# EasyEDA Pro project 无人机主控.epro, board PCB_PCB_PCB_STM32F103C8T6(gift)_2023-09-09_2023-10-22 copy(1)
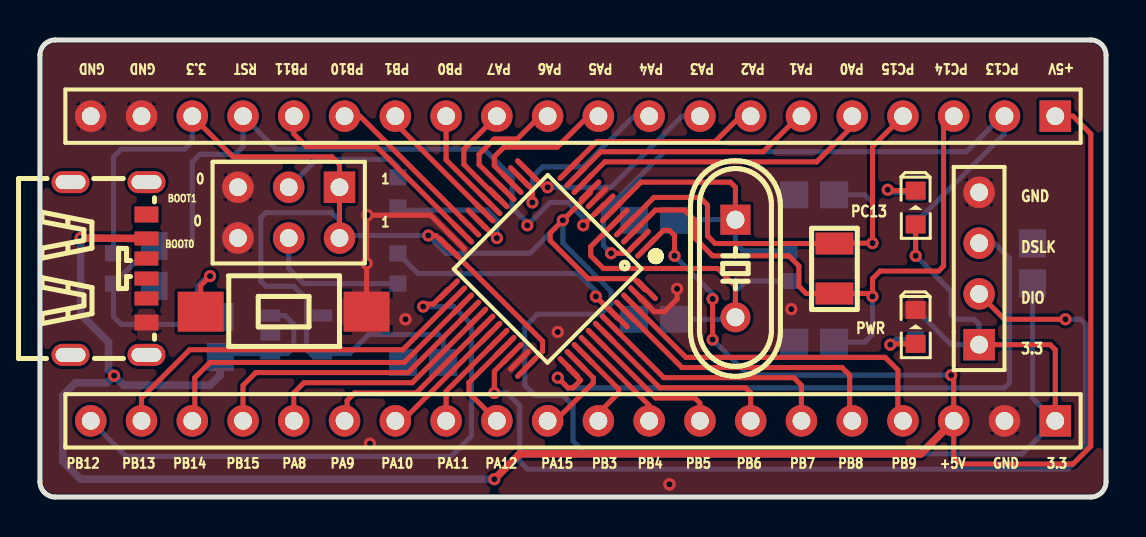
[diagram p1: board, top side]
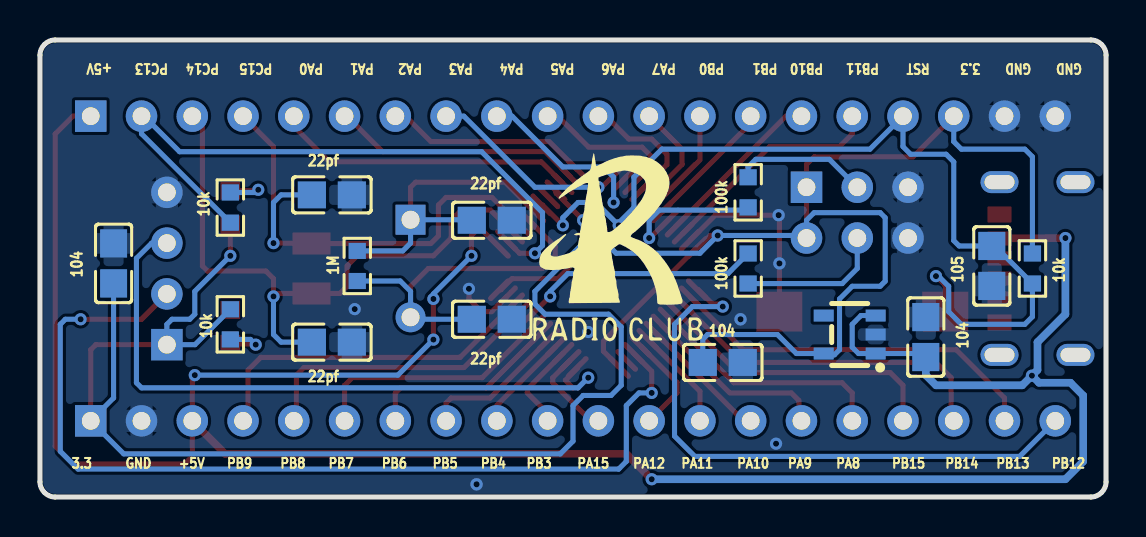
[diagram p2: board, bottom side, seen from below]

Outline 53.34 x 22.86 mm; copper layers: Top Layer, Bottom Layer. Coordinates in mm from the lower left corner of the outline.
Outline path: 0,22.1 arc(0.22,22.64) 0.76,22.86 52.58,22.86 arc(53.12,22.64) 53.34,22.1 53.34,0.76 arc(53.12,0.22) 52.58,0 0.76,0 arc(0.22,0.22) 0,0.76 0,22.1

## Design rules (mm)
spacing Default (default): track to track 0.152, other pairs 0 to 0.152
track width Default (default): min 0.254, default 0.254, max 25.4
via Default (default): diameter min 0.61, default 0.61, max 100.025; hole min 0.305, default 0.305, max 59.995
pour e270 uses gge11324
pour e448 uses gge11333

## Placement (name value [footprint] x y rotation side)
C1  20pF  [C0805]  30.73 8.89 180 bottom
C2  20pF  [C0805]  30.73 13.84 180 bottom
C3  20pF  [C0805]  38.74 7.75 0 bottom
C4  20pF  [C0805]  38.74 15.11 0 bottom
C5  104  [C0805]  9.02 8 270 bottom
C6  104  [C0805]  49.66 11.68 270 bottom
C7  104  [C0805]  19.18 6.73 0 bottom
C8  105  [C0805]  5.72 11.56 270 bottom
H1  HDR-F-2.54_1x4  [HDR-F-2.54_1X4]  46.99 11.43 90 top
H2  HDR-F-2.54_1x20  [HDR-F-2.54_1X20]  26.67 19.05 180 top
H3  HDR-F-2.54_1x20  [HDR-F-2.54_1X20]  26.67 3.81 180 top
J1  HDR-M-2.54_2x3  [HDR-M-2.54_2X3]  14.99 15.49 180 top
LED1  LED-0603_R  [LED0603_RED]  43.82 14.48 90 top
LED2  LED-0603_R  [LED0603_RED]  43.82 8.51 90 top
R1  1M  [R0603]  37.47 11.56 270 bottom
R2  10k  [R0603]  43.81 8.64 270 bottom
R3  1k  [R0603]  43.81 14.48 90 bottom
R4  100k  [R0603]  17.91 15.24 90 bottom
R5  100k  [R0603]  17.91 11.43 270 bottom
R6  10k  [R0603]  3.68 11.43 270 bottom
SW1  1TS002B-2500-5000  [SW-SMD_L3.5-W6.0-P8.20]  12.19 9.27 0 top
U1  TPS70933DBVR-TP  [SOT-23-5_L3.0-W1.7-P0.95-LS2.8-BR]  12.83 8.13 180 bottom
U2  STM32F103C8T6  [LQFP-48_L7.0-W7.0-P0.50-LS9.0-BL]  25.4 11.43 135 top
USB1  TYPE-C 6P  [TYPE-C-SMD_TYPE-C-6P]  3.43 11.43 270 top
X1  8MHz  [HC-49US_L11.5-W4.5-P4.88]  34.8 11.43 270 top
Y1  32.768kHz  [SMD3215]  39.75 11.43 270 top

## Footprints (pads in the part's own frame, mm; a bottom-side part is the same pattern mirrored in y, then rotated)
C0805
  rect 1.41x1.35 smd: 1(-1,0) 2(1,0)
HC-49US_L11.5-W4.5-P4.88
  rect 1.5x1.5 hole 0.9: 1(-2.44,0)
  round 1.5 hole 0.9: 2(2.44,0)
HDR-F-2.54_1X4
  rect 1.575x1.575 hole 0.889: 1(-3.81,0)
  round 1.575 hole 0.889: 2(-1.27,0) 3(1.27,0) 4(3.81,0)
HDR-F-2.54_1X20
  rect 1.575x1.575 hole 0.889: 1(-24.13,0)
  round 1.575 hole 0.889: 2(-21.59,0) 3(-19.05,0) 4(-16.51,0) 5(-13.97,0) 6(-11.43,0) 7(-8.89,0) 8(-6.35,0) 9(-3.81,0) 10(-1.27,0) 11(1.27,0) 12(3.81,0) 13(6.35,0) 14(8.89,0) 15(11.43,0) 16(13.97,0) 17(16.51,0) 18(19.05,0) 19(21.59,0) 20(24.13,0)
HDR-M-2.54_2X3
  rect 1.575x1.575 hole 0.889: 1(0,0)
  round 1.575 hole 0.889: 2(0,2.54) 3(2.54,0) 4(2.54,2.54) 5(5.08,0) 6(5.08,2.54)
LED0603_RED
  rect 0.9x1 smd: 1(-0.85,0) 2(0.85,0)
LQFP-48_L7.0-W7.0-P0.50-LS9.0-BL
  oval 0.27x1.5 smd: 1(-2.75,-4.25) 2(-2.25,-4.25) 3(-1.75,-4.25) 4(-1.25,-4.25) 5(-0.75,-4.25) 6(-0.25,-4.25) 7(0.25,-4.25) 8(0.75,-4.25) 9(1.25,-4.25) 10(1.75,-4.25) 11(2.25,-4.25) 12(2.75,-4.25) 25(2.75,4.25) 26(2.25,4.25) 27(1.75,4.25) 28(1.25,4.25) 29(0.75,4.25) 30(0.25,4.25) 31(-0.25,4.25) 32(-0.75,4.25) 33(-1.25,4.25) 34(-1.75,4.25) 35(-2.25,4.25) 36(-2.75,4.25)
  oval 1.5x0.27 smd: 13(4.25,-2.75) 14(4.25,-2.25) 15(4.25,-1.75) 16(4.25,-1.25) 17(4.25,-0.75) 18(4.25,-0.25) 19(4.25,0.25) 20(4.25,0.75) 21(4.25,1.25) 22(4.25,1.75) 23(4.25,2.25) 24(4.25,2.75) 37(-4.25,2.75) 38(-4.25,2.25) 39(-4.25,1.75) 40(-4.25,1.25) 41(-4.25,0.75) 42(-4.25,0.25) 43(-4.25,-0.25) 44(-4.25,-0.75) 45(-4.25,-1.25) 46(-4.25,-1.75) 47(-4.25,-2.25) 48(-4.25,-2.75)
R0603
  rect 0.806x0.864 smd: 1(-0.753,0) 2(0.753,0)
SMD3215
  rect 1.1x1.9 smd: 1(-1.25,0) 2(1.25,0)
SOT-23-5_L3.0-W1.7-P0.95-LS2.8-BR
  rect 1x0.6 smd: 1(1.3,-0.95) 2(1.3,0) 3(1.3,0.95) 4(-1.3,0.95) 5(-1.3,-0.95)
SW-SMD_L3.5-W6.0-P8.20
  rect 2.3x2 smd: A(-4.15,0) B(4.15,0)
TYPE-C-SMD_TYPE-C-6P
  oval 1.1x1.9 hole 0.7x1.5: 7(-4.32,1.9) 7(-4.32,-1.9) 7(4.32,1.9) 7(4.32,-1.9)
  rect 0.7x1.2 smd: A5(-0.5,1.9) A9(1.5,1.9) B5(0.5,1.9) B9(-1.5,1.9)
  rect 0.8x1.2 smd: A12(2.7,1.9) B12(-2.7,1.9)

## Nets
+3.3V: C6.2 C7.2 H1.1 H2.18 H3.1 J1.1 J1.2 LED1.1 R2.1 R6.1 U1.5 U2.9 U2.24 U2.36 U2.48
+5V: C5.2 H2.1 H3.3 U1.1 U1.3 U2.1 USB1.B9
GND: C1.2 C2.2 C3.1 C4.1 C5.1 C6.1 C7.1 C8.2 H1.4 H2.19 H2.20 H3.2 J1.5 J1.6 LED2.2 SW1.B U1.2 U2.8 U2.23 U2.35 U2.47 USB1.A12
BOOT0: R5.1 U2.44
BOOT1: R4.1 U2.20
J1_3: J1.3 R4.2
J1_4: J1.4 R5.2
LED1_2: LED1.2 R3.2
OSC1: C1.1 R1.2 U2.5 X1.2
OSC2: C2.1 R1.1 U2.6 X1.1
PA0: H2.5 U2.10
PA1: H2.6 U2.11
PA2: H2.7 U2.12
PA3: H2.8 U2.13
PA4: H2.9 U2.14
PA5: H2.10 U2.15
PA6: H2.11 U2.16
PA7: H2.12 U2.17
PA8: H3.16 U2.29
PA9: H3.15 U2.30
PA10: H3.14 U2.31
PA11: H3.13 U2.32
PA12: H3.12 U2.33
PA13: H1.2 U2.34
PA14: H1.3 U2.37
PA15: H3.11 U2.38
PB0: H2.13 U2.18
PB1: H2.14 U2.19
PB3: H3.10 U2.39
PB4: H3.9 U2.40
PB5: H3.8 U2.41
PB6: H3.7 U2.42
PB7: H3.6 U2.43
PB8: H3.5 U2.45
PB9: H3.4 U2.46
PB10: H2.15 U2.21
PB11: H2.16 U2.22
PB12: H3.20 U2.25
PB13: H3.19 U2.26
PB14: H3.18 U2.27
PB15: H3.17 U2.28
PC13: H2.2 R3.1 U2.2
PC14: C3.2 H2.3 U2.3 Y1.2
PC15: C4.2 H2.4 U2.4 Y1.1
R2_2: LED2.1 R2.2
RST: C8.1 H2.17 R6.2 SW1.A U2.7

Pads without a net: U1 4; USB1 7 A5 A9 B5 B12

## Via types
v1: diameter 0.61, hole 0.305, Top Layer to Bottom Layer, 30 vias
v2: diameter 0.62, hole 0.31, Top Layer to Bottom Layer, 4 vias

## Routing (per net, layer and track width the routed paths; a pad name or vN(x,y) marks a point on that pad's centre or on a via; arc(x,y) is an arc through that point)
+3.3V: length 145.3
  Top Layer w0.254: H3.1 50.8,7.37 50.55,7.62 H1.1 ; 15.37,12.45 14.99,12.83 J1.1 14.99,16.64 14.6,17.02 9.65,17.02 H2.18 ; U2.36 25.15,7.29 25.15,7.8 U2.24 20.4,12.49 19.81,13.08 v1(19.43,13.08) ; LED1.1 v1(43.81,12.06) ; U2.9 27.52,15.2 v1(26.16,13.84) 25.53,13.21 25.53,12.83 27.43,10.92 29.72,10.92 30.27,10.37 U2.48
  Bottom Layer w0.254: R6.1 3.68,17.02 4.06,17.4 7.24,17.4 7.62,17.78 H2.18 ; v1(43.81,12.06) 45.59,10.29 45.59,9.14 45.85,8.89 46.74,8.89 46.99,8.64 H1.1 45.58,7.62 R2.1 ; C7.2 20.18,7.89 19.94,8.13 16.44,8.13 15.49,7.18 U1.5 14.06,7.11 13.59,7.11 13.34,7.37 13.34,9.91 12.7,10.54 11.3,10.54 11.05,10.8 11.05,13.97 11.3,14.22 14.6,14.22 14.99,13.84 J1.2 15.11,13.08 v1(19.43,13.08) 20.32,12.19 24.51,12.19 v1(26.16,13.84) 26.16,12.7 28.57,10.29 28.57,9.65 28.07,9.14 24.89,9.14 24.26,8.51 24.26,5.59 24.76,5.08 26.16,5.08 26.67,4.57 26.67,2.79 27.31,2.16 49.15,2.16 H3.1 49.66,4.95 C6.2
+5V: length 126.1
  Top Layer w0.254: v1(33.66,9.91) v1(33.66,7.87) ; H2.1 51.69,19.05 52.58,18.16 52.58,2.54 51.69,1.65 46.1,1.65 45.72,2.03 H3.3 45.72,5.97 v1(45.59,6.1) ; U2.1 31.19,13.33 31.5,13.33 31.75,13.08 v1(31.75,12.06)
  Top Layer w0.381: H3.3 44.07,2.16 24,2.16 v1(22.73,0.89) ; v1(2.03,12.95) 5.33,12.93
  Bottom Layer w0.254: v1(45.59,6.1) 35.43,6.1 v1(33.66,7.87) ; C5.2 9.19,7.18 U1.1 12.38,7.18 12.7,7.49 12.7,8.64 12.26,9.08 U1.3 ; v1(33.66,9.91) 33.66,10.16 v1(31.75,12.06)
  Bottom Layer w0.381: C5.2 9.02,6.1 8.51,5.59 4.19,5.59 v1(3.71,6.07) ; v1(22.73,0.89) 2.03,0.89 1.14,1.78 1.14,5.08 1.78,5.72 3.35,5.72 v1(3.71,6.07) ; v1(3.71,6.07) 3.43,6.35 3.43,7.75 2.03,9.14 v1(2.03,12.95)
GND: length 12.7
  Top Layer w0.254: U2.47 30.74,9.27 31.24,9.27 31.88,9.91 v1(31.88,10.41) ; U2.23 19.55,14.1 v2(16.38,14.1) 16.34,14.06 SW1.B
  vias: v1(16.51,2.67) v1(25.91,8.25) v1(37.59,9.4) v2(16.34,11.68) v2(18.29,8.89) v2(31.5,0.64)
BOOT0: length 12.5
  Top Layer w0.254: U2.44 28.89,8.95 v1(27.81,10.03)
  Bottom Layer w0.254: v1(27.81,10.03) 27.81,10.29 26.92,11.18 18.91,11.18 R5.1
BOOT1: length 7.5
  Top Layer w0.254: v1(22.86,12.95) 22.81,12.95 U2.20
  Bottom Layer w0.254: R4.1 18.04,14.35 22.35,14.35 22.86,13.84 v1(22.86,12.95)
J1_3: length 6.7
  Bottom Layer w0.254: R4.2 17.91,16.51 17.53,16.89 13.84,16.89 J1.3
J1_4: length 7.3
  Bottom Layer w0.254: R5.2 13.2,10.68 12.45,11.43 J1.4
LED1_2: length 2.9
  Top Layer w0.254: v1(42.42,15.37) 42.46,15.33 LED1.2
  Bottom Layer w0.254: v1(42.42,15.37) 42.55,15.23 R3.2
OSC1: length 19.1
  Top Layer w0.254: U2.5 27.56,12.53 27.56,12.06 28.19,11.43 33.91,11.43 34.8,10.54 X1.2
  Bottom Layer w0.254: R1.2 35.31,10.8 34.8,10.29 X1.2 34.7,8.89 C1.1
OSC2: length 15.6
  Top Layer w0.254: X1.1 34.8,15.49 34.54,15.75 30.07,15.75 U2.6
  Bottom Layer w0.254: R1.1 35.19,12.31 34.8,12.7 X1.1 31.76,13.87 C2.1
PA0: length 15.2
  Top Layer w0.254: U2.10 28.26,16.76 38.86,16.76 40.64,18.54 H2.5
PA1: length 12.5
  Top Layer w0.254: U2.11 28.06,17.27 36.19,17.27 37.97,19.05 H2.6
PA2: length 10.2
  Top Layer w0.254: U2.12 27.86,17.78 33.78,17.78 35.05,19.05 H2.7
PA3: length 10.5
  Top Layer w0.254: U2.13 25.22,15.49 v1(25.4,15.49)
  Bottom Layer w0.254: v1(25.4,15.49) 28.57,15.49 32.13,19.05 H2.8
PA4: length 9.9
  Top Layer w0.254: v1(24.64,14.73) 24.64,15.37 U2.14
  Bottom Layer w0.254: v1(24.64,14.73) 24.64,16 25.15,16.51 27.18,16.51 29.72,19.05 H2.9
PA5: length 7.8
  Top Layer w0.254: H2.10 27.43,19.05 25.88,17.5 23.21,17.5 22.73,17.02 22.73,16.57 U2.15
PA6: length 6.6
  Top Layer w0.254: H2.11 25.02,19.05 23.88,17.91 22.73,17.91 21.97,17.14 21.97,16.63 U2.16
PA7: length 5.5
  Top Layer w0.254: H2.12 21.21,17.4 21.21,16.64 22.88,14.97 22.93,14.97
PA8: length 12.1
  Top Layer w0.254: H3.16 12.7,5.21 13.21,5.72 18.62,5.72 U2.29
PA9: length 9.5
  Top Layer w0.254: U2.30 18.82,5.21 15.75,5.21 15.37,4.83 15.37,3.94 H3.15
PA10: length 6.6
  Top Layer w0.254: U2.31 18.13,3.81 H3.14
PA11: length 5.2
  Top Layer w0.254: 22.93,7.89 20.32,5.29 H3.13
PA12: length 5.1
  Top Layer w0.254: 23.28,7.54 21.46,5.72 21.46,5.21 H3.12
PA13: length 47.8
  Top Layer w0.254: v1(22.73,5.21) 22.73,6.29 U2.34 ; v1(51.31,8.89) 48.26,8.89 H1.2
  Bottom Layer w0.254: v1(51.31,8.89) 52.07,8.89 52.32,8.64 52.32,2.29 51.44,1.4 24.38,1.4 24,1.78 24,4.57 23.37,5.21 v1(22.73,5.21)
PA14: length 33.4
  Top Layer w0.254: v1(25.91,5.97) 26.42,5.46 26.67,5.46 27.05,5.84 26.46,6.43 U2.37
  Bottom Layer w0.254: H1.3 47.75,12.7 48.51,11.94 48.51,5.72 48.26,5.46 26.42,5.46 v1(25.91,5.97)
PA15: length 4.6
  Top Layer w0.254: U2.38 27.69,5.96 27.69,5.72 25.78,3.81 H3.11
PB0: length 5.4
  Top Layer w0.254: H2.13 20.32,16.86 U2.18
PB1: length 6.6
  Top Layer w0.254: U2.19 17.78,18.7 H2.14
PB3: length 4.5
  Top Layer w0.254: H3.10 27.94,4.19 28.96,5.21 28.96,5.4 U2.39
PB4: length 5
  Top Layer w0.254: U2.40 30.48,4.58 H3.9
PB5: length 7.4
  Top Layer w0.254: H3.8 33.02,4.7 32.77,4.95 30.82,4.95 27.88,7.89
PB6: length 10
  Top Layer w0.254: H3.7 35.56,5.21 35.31,5.46 31.02,5.46 U2.42
PB7: length 12.5
  Top Layer w0.254: U2.43 31.21,5.97 37.72,5.97 38.1,5.59 H3.6
PB8: length 14.9
  Top Layer w0.254: 29.29,9.31 32.12,6.48 40.13,6.48 40.51,6.1 40.51,3.94 H3.5
PB9: length 17.3
  Top Layer w0.254: U2.46 32.32,6.98 42.29,6.98 42.93,6.35 42.93,4.06 H3.4
PB10: length 8.5
  Top Layer w0.254: 21.51,13.55 16.01,19.05 H2.15
PB11: length 11.4
  Top Layer w0.254: U2.22 16.83,17.53 13.34,17.53 12.7,18.16 H2.16
PB12: length 30.2
  Top Layer w0.254: v1(19.18,9.53) 19.3,9.65 19.69,9.65 20.4,10.37 U2.25
  Bottom Layer w0.254: v1(19.18,9.53) 20.7,9.53 21.59,8.64 21.59,3.05 20.57,2.03 4.32,2.03 H3.20
PB13: length 19
  Top Layer w0.254: H3.19 5.08,4.95 7.49,7.37 18.15,7.37 U2.26
PB14: length 17.2
  Top Layer w0.254: U2.27 18.23,6.73 8.51,6.73 7.75,5.97 7.75,3.94 H3.18
PB15: length 14.7
  Top Layer w0.254: 21.51,9.31 18.43,6.22 10.79,6.22 10.16,5.59 H3.17
PC13: length 33.1
  Top Layer w0.254: U2.2 29.34,12.19 v1(28.57,12.19)
  Bottom Layer w0.254: R3.1 48.26,18.17 H2.2 48.13,19.05 46.35,17.27 31.24,17.27 28.19,14.22 28.19,12.57 v1(28.57,12.19)
PC14: length 31.8
  Top Layer w0.254: H2.3 45.21,18.54 45.21,11.56 44.96,11.3 42.04,11.3 41.66,10.92 v1(41.66,10.03) 41.51,10.18 Y1.2 38.33,10.18 37.97,10.54 37.97,11.56 37.47,12.06 33.66,12.06 32.77,12.95 32.77,13.84 32.26,14.35 30.8,14.35 U2.3
  Bottom Layer w0.254: C3.2 41.28,7.75 41.66,8.13 v1(41.66,10.03)
PC15: length 25.9
  Top Layer w0.254: 29.29,13.55 30.72,14.99 33.02,14.99 33.4,14.61 33.4,13.06 33.78,12.68 Y1.1 v1(41.66,12.7) 41.66,17.53 H2.4
  Bottom Layer w0.254: C4.2 41.28,15.11 41.66,14.73 v1(41.66,12.7)
R2_2: length 2.7
  Top Layer w0.254: LED2.1 42.58,7.66 v1(42.54,7.62)
  Bottom Layer w0.254: R2.2 42.81,7.88 v1(42.54,7.62)
RST: length 46.4
  Top Layer w0.254: v1(27.18,13.59) 28.2,14.61 U2.7 ; SW1.A 8.04,10.58 v1(8.51,11.05)
  Bottom Layer w0.254: v1(8.51,11.05) 8.38,11.05 7.87,10.54 7.87,9.27 7.24,8.64 4.06,8.64 3.68,9.02 R6.2 5.56,12.56 C8.1 7.35,12.56 7.62,12.83 7.62,16.76 8,17.14 9.78,17.14 10.16,17.53 H2.17 11.81,17.4 22.22,17.4 23.62,16 23.62,14.48 24.38,13.72 v1(24.38,13.59) 25.53,14.73 26.42,14.73 27.18,13.97 v1(27.18,13.59)

## Copper pours and planes (outline as drawn; the poured copper is in the pictures)
GND on Top Layer: -1.78,24.77 -1.78,0 -2.54,-0.76 53.97,-0.76 54.86,0.13 54.86,24.89
GND on Bottom Layer: -1.65,25.15 -1.65,-0.25 -2.41,-1.02 55.25,-1.02 55.5,-0.76 55.5,25.53 55.37,25.65

## Text on the board
Bottom Silkscreen Layer: GND | 3.3 | RST | PB11 | PB10 | PB1 | PB0 | PA7 | PA6 | PA5 | PA4 | PA3 | PA2 | PA1 | PA0 | PC15 | PC14 | PC13 | +5V | PB12 | PB13 | PB14 | PB15 | PA8 | PA9 | PA10 | PA11 | PA12 | PA15 | PB3 | PB4 | PB5 | PB6 | PB7 | PB8 | PB9 | 10k | 104 | 105 | 100k | 1M | 22pf
Top Silkscreen Layer: BOOT0 | BOOT1 | PB12 | PB13 | PB14 | 0 | PB15 | PA8 | PA9 | 1 | PA10 | PA11 | PA12 | PA15 | PB3 | PB4 | PB5 | PB6 | PB7 | PB8 | PB9 | +5V | GND | 3.3 | RST | PB11 | PB10 | PB1 | PB0 | PA7 | PA6 | PA5 | PA4 | PA3 | PA2 | PA1 | PA0 | PC15 | PC14 | PC13 | PWR | DSLK | DIO
